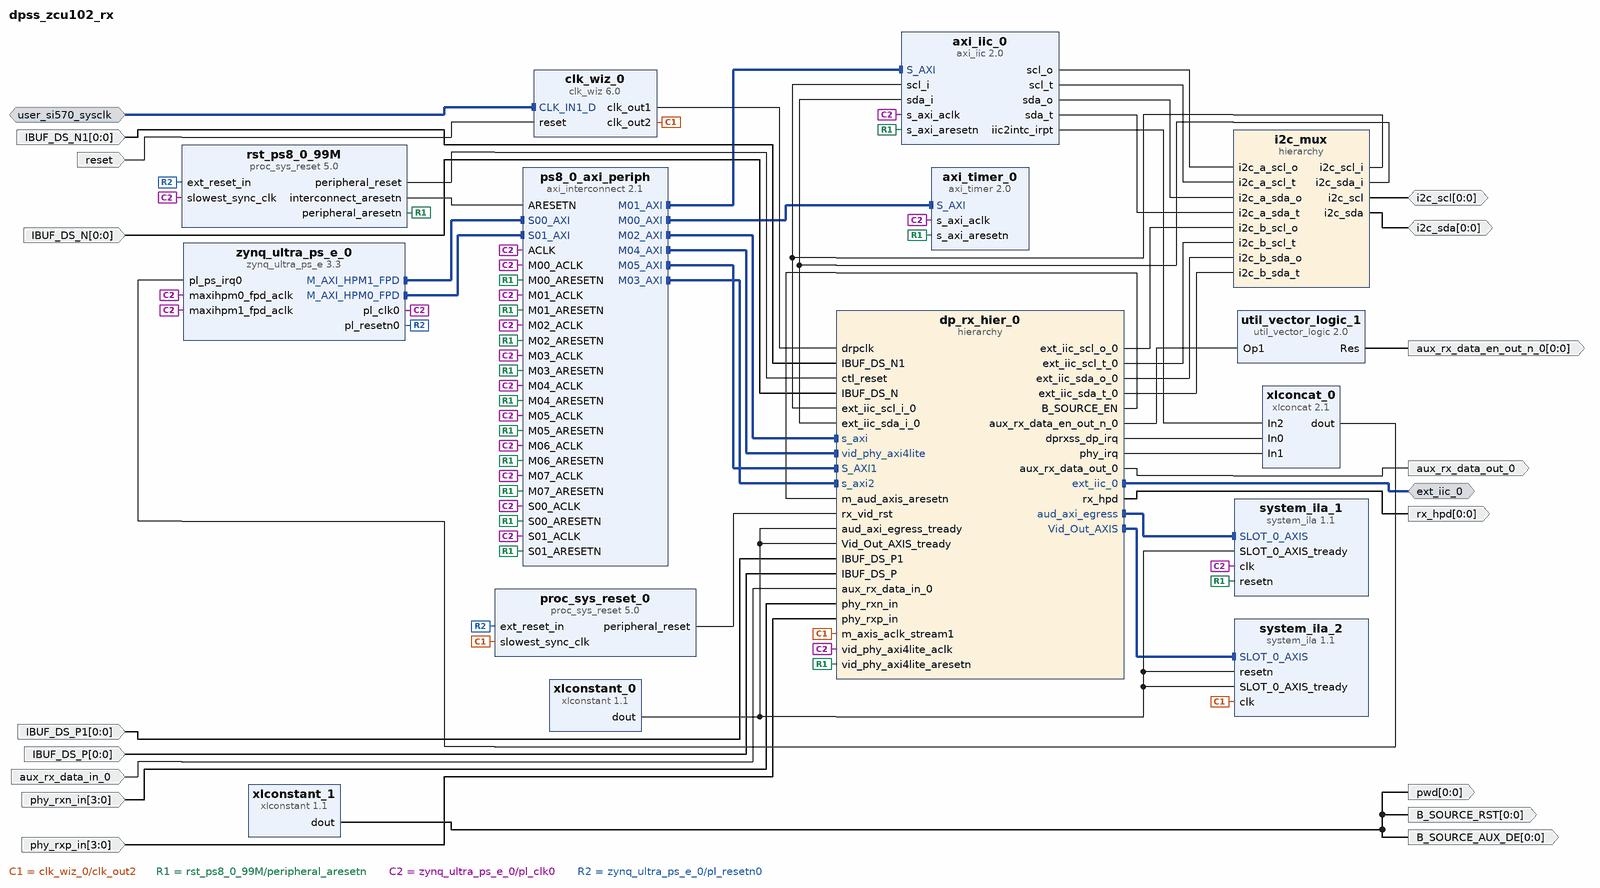
[diagram p0: block diagram of the top level]
# Vivado block design dpss_zcu102_rx, xczu9eg-ffvb1156-2-e, Vivado 2019.2
create_bd_design dpss_zcu102_rx

create_bd_intf_port -mode Master -vlnv xilinx.com:interface:iic_rtl:1.0 ext_iic_0
create_bd_intf_port -mode Slave -vlnv xilinx.com:interface:diff_clock_rtl:1.0 user_si570_sysclk
set_property -dict {CONFIG.FREQ_HZ 300000000} [get_bd_intf_ports user_si570_sysclk]
create_bd_port -dir O -from 0 -to 0 B_SOURCE_AUX_DE
create_bd_port -dir O -from 0 -to 0 B_SOURCE_RST
create_bd_port -dir I -from 0 -to 0 -type clk IBUF_DS_N
create_bd_port -dir I -from 0 -to 0 -type clk IBUF_DS_N1
create_bd_port -dir I -from 0 -to 0 -type clk IBUF_DS_P
create_bd_port -dir I -from 0 -to 0 -type clk IBUF_DS_P1
create_bd_port -dir O -from 0 -to 0 aux_rx_data_en_out_n_0
create_bd_port -dir I aux_rx_data_in_0
create_bd_port -dir O aux_rx_data_out_0
create_bd_port -dir IO -from 0 -to 0 i2c_scl
create_bd_port -dir IO -from 0 -to 0 i2c_sda
create_bd_port -dir I -from 3 -to 0 phy_rxn_in
create_bd_port -dir I -from 3 -to 0 phy_rxp_in
create_bd_port -dir O -from 0 -to 0 pwd
create_bd_port -dir I -type rst reset
set_property -dict {CONFIG.POLARITY ACTIVE_HIGH} [get_bd_ports reset]
create_bd_port -dir O -from 0 -to 0 -type data rx_hpd

create_bd_cell -type ip -vlnv xilinx.com:ip:axi_iic:2.0 axi_iic_0
set_property -dict {CONFIG.C_GPO_WIDTH 2 CONFIG.IIC_FREQ_KHZ 10} [get_bd_cells axi_iic_0]
create_bd_cell -type ip -vlnv xilinx.com:ip:axi_timer:2.0 axi_timer_0
create_bd_cell -type ip -vlnv xilinx.com:ip:clk_wiz:6.0 clk_wiz_0
set_property -dict [list \
  CONFIG.CLKOUT1_JITTER 119.271 \
  CONFIG.CLKOUT1_REQUESTED_OUT_FREQ 40 \
  CONFIG.CLKOUT2_JITTER 77.563 \
  CONFIG.CLKOUT2_PHASE_ERROR 77.959 \
  CONFIG.CLKOUT2_REQUESTED_OUT_FREQ 350.000 \
  CONFIG.CLKOUT2_USED true \
  CONFIG.CLK_IN1_BOARD_INTERFACE user_si570_sysclk \
  CONFIG.MMCM_CLKOUT0_DIVIDE_F 26.250 \
  CONFIG.MMCM_CLKOUT1_DIVIDE 3 \
  CONFIG.MMCM_DIVCLK_DIVIDE 1 \
  CONFIG.NUM_OUT_CLKS 2 \
  CONFIG.RESET_BOARD_INTERFACE reset \
  CONFIG.USE_BOARD_FLOW true \
] [get_bd_cells clk_wiz_0]
create_bd_cell -type hier dp_rx_hier_0
create_bd_cell -type hier i2c_mux
create_bd_cell -type ip -vlnv xilinx.com:ip:proc_sys_reset:5.0 proc_sys_reset_0
create_bd_cell -type ip -vlnv xilinx.com:ip:axi_interconnect:2.1 ps8_0_axi_periph
set_property -dict {CONFIG.NUM_MI 8 CONFIG.NUM_SI 2} [get_bd_cells ps8_0_axi_periph]
create_bd_cell -type ip -vlnv xilinx.com:ip:proc_sys_reset:5.0 rst_ps8_0_99M
create_bd_cell -type ip -vlnv xilinx.com:ip:system_ila:1.1 system_ila_1
set_property -dict [list \
  CONFIG.C_MON_TYPE INTERFACE \
  CONFIG.C_SLOT_0_INTF_TYPE xilinx.com:interface:axis_rtl:1.0 \
] [get_bd_cells system_ila_1]
create_bd_cell -type ip -vlnv xilinx.com:ip:system_ila:1.1 system_ila_2
set_property -dict [list \
  CONFIG.C_MON_TYPE INTERFACE \
  CONFIG.C_SLOT_0_INTF_TYPE xilinx.com:interface:axis_rtl:1.0 \
] [get_bd_cells system_ila_2]
create_bd_cell -type ip -vlnv xilinx.com:ip:util_vector_logic:2.0 util_vector_logic_1
set_property -dict {CONFIG.C_OPERATION not CONFIG.C_SIZE 1} [get_bd_cells util_vector_logic_1]
create_bd_cell -type ip -vlnv xilinx.com:ip:xlconcat:2.1 xlconcat_0
set_property -dict {CONFIG.NUM_PORTS 3} [get_bd_cells xlconcat_0]
create_bd_cell -type ip -vlnv xilinx.com:ip:xlconstant:1.1 xlconstant_0
create_bd_cell -type ip -vlnv xilinx.com:ip:xlconstant:1.1 xlconstant_1
set_property -dict {CONFIG.CONST_VAL 0} [get_bd_cells xlconstant_1]
create_bd_cell -type ip -vlnv xilinx.com:ip:zynq_ultra_ps_e:3.3 zynq_ultra_ps_e_0
set_property -dict [list \
  CONFIG.CAN0_BOARD_INTERFACE custom \
  CONFIG.CAN1_BOARD_INTERFACE custom \
  CONFIG.CSU_BOARD_INTERFACE custom \
  CONFIG.DP_BOARD_INTERFACE custom \
  CONFIG.GEM0_BOARD_INTERFACE custom \
  CONFIG.GEM1_BOARD_INTERFACE custom \
  CONFIG.GEM2_BOARD_INTERFACE custom \
  CONFIG.GEM3_BOARD_INTERFACE custom \
  CONFIG.GPIO_BOARD_INTERFACE custom \
  CONFIG.IIC0_BOARD_INTERFACE custom \
  CONFIG.IIC1_BOARD_INTERFACE custom \
  CONFIG.NAND_BOARD_INTERFACE custom \
  CONFIG.PCIE_BOARD_INTERFACE custom \
  CONFIG.PJTAG_BOARD_INTERFACE custom \
  CONFIG.PMU_BOARD_INTERFACE custom \
  CONFIG.PSU_BANK_0_IO_STANDARD LVCMOS18 \
  CONFIG.PSU_BANK_1_IO_STANDARD LVCMOS18 \
  CONFIG.PSU_BANK_2_IO_STANDARD LVCMOS18 \
  CONFIG.PSU_BANK_3_IO_STANDARD LVCMOS33 \
  CONFIG.PSU_USB3__DUAL_CLOCK_ENABLE 1 \
  CONFIG.PSU__CAN1__PERIPHERAL__ENABLE 1 \
  CONFIG.PSU__CAN1__PERIPHERAL__IO {MIO 24 .. 25} \
  CONFIG.PSU__CRF_APB__ACPU_CTRL__FREQMHZ 1200 \
  CONFIG.PSU__CRF_APB__ACPU_CTRL__SRCSEL APLL \
  CONFIG.PSU__CRF_APB__APLL_CTRL__SRCSEL PSS_REF_CLK \
  CONFIG.PSU__CRF_APB__DBG_FPD_CTRL__FREQMHZ 250 \
  CONFIG.PSU__CRF_APB__DBG_FPD_CTRL__SRCSEL IOPLL \
  CONFIG.PSU__CRF_APB__DBG_TRACE_CTRL__FREQMHZ 250 \
  CONFIG.PSU__CRF_APB__DBG_TRACE_CTRL__SRCSEL IOPLL \
  CONFIG.PSU__CRF_APB__DBG_TSTMP_CTRL__FREQMHZ 250 \
  CONFIG.PSU__CRF_APB__DBG_TSTMP_CTRL__SRCSEL IOPLL \
  CONFIG.PSU__CRF_APB__DDR_CTRL__FREQMHZ 1067 \
  CONFIG.PSU__CRF_APB__DDR_CTRL__SRCSEL DPLL \
  CONFIG.PSU__CRF_APB__DPDMA_REF_CTRL__FREQMHZ 600 \
  CONFIG.PSU__CRF_APB__DPDMA_REF_CTRL__SRCSEL APLL \
  CONFIG.PSU__CRF_APB__DPLL_CTRL__SRCSEL PSS_REF_CLK \
  CONFIG.PSU__CRF_APB__DP_AUDIO_REF_CTRL__SRCSEL RPLL \
  CONFIG.PSU__CRF_APB__DP_STC_REF_CTRL__SRCSEL RPLL \
  CONFIG.PSU__CRF_APB__DP_VIDEO_REF_CTRL__SRCSEL VPLL \
  CONFIG.PSU__CRF_APB__GDMA_REF_CTRL__FREQMHZ 600 \
  CONFIG.PSU__CRF_APB__GDMA_REF_CTRL__SRCSEL APLL \
  CONFIG.PSU__CRF_APB__GPU_REF_CTRL__FREQMHZ 500 \
  CONFIG.PSU__CRF_APB__GPU_REF_CTRL__SRCSEL IOPLL \
  CONFIG.PSU__CRF_APB__TOPSW_LSBUS_CTRL__FREQMHZ 100 \
  CONFIG.PSU__CRF_APB__TOPSW_LSBUS_CTRL__SRCSEL IOPLL \
  CONFIG.PSU__CRF_APB__TOPSW_MAIN_CTRL__FREQMHZ 533.33 \
  CONFIG.PSU__CRF_APB__TOPSW_MAIN_CTRL__SRCSEL DPLL \
  CONFIG.PSU__CRF_APB__VPLL_CTRL__SRCSEL PSS_REF_CLK \
  CONFIG.PSU__CRL_APB__ADMA_REF_CTRL__FREQMHZ 500 \
  CONFIG.PSU__CRL_APB__ADMA_REF_CTRL__SRCSEL IOPLL \
  CONFIG.PSU__CRL_APB__CAN1_REF_CTRL__FREQMHZ 100 \
  CONFIG.PSU__CRL_APB__CAN1_REF_CTRL__SRCSEL IOPLL \
  CONFIG.PSU__CRL_APB__CPU_R5_CTRL__FREQMHZ 500 \
  CONFIG.PSU__CRL_APB__CPU_R5_CTRL__SRCSEL IOPLL \
  CONFIG.PSU__CRL_APB__DBG_LPD_CTRL__FREQMHZ 250 \
  CONFIG.PSU__CRL_APB__DBG_LPD_CTRL__SRCSEL IOPLL \
  CONFIG.PSU__CRL_APB__GEM3_REF_CTRL__FREQMHZ 125 \
  CONFIG.PSU__CRL_APB__GEM3_REF_CTRL__SRCSEL IOPLL \
  CONFIG.PSU__CRL_APB__I2C0_REF_CTRL__FREQMHZ 100 \
  CONFIG.PSU__CRL_APB__I2C0_REF_CTRL__SRCSEL IOPLL \
  CONFIG.PSU__CRL_APB__I2C1_REF_CTRL__FREQMHZ 100 \
  CONFIG.PSU__CRL_APB__I2C1_REF_CTRL__SRCSEL IOPLL \
  CONFIG.PSU__CRL_APB__IOPLL_CTRL__SRCSEL PSS_REF_CLK \
  CONFIG.PSU__CRL_APB__IOU_SWITCH_CTRL__FREQMHZ 250 \
  CONFIG.PSU__CRL_APB__IOU_SWITCH_CTRL__SRCSEL IOPLL \
  CONFIG.PSU__CRL_APB__LPD_LSBUS_CTRL__FREQMHZ 100 \
  CONFIG.PSU__CRL_APB__LPD_LSBUS_CTRL__SRCSEL IOPLL \
  CONFIG.PSU__CRL_APB__LPD_SWITCH_CTRL__FREQMHZ 500 \
  CONFIG.PSU__CRL_APB__LPD_SWITCH_CTRL__SRCSEL IOPLL \
  CONFIG.PSU__CRL_APB__PCAP_CTRL__FREQMHZ 200 \
  CONFIG.PSU__CRL_APB__PCAP_CTRL__SRCSEL IOPLL \
  CONFIG.PSU__CRL_APB__PL0_REF_CTRL__FREQMHZ 100 \
  CONFIG.PSU__CRL_APB__PL0_REF_CTRL__SRCSEL IOPLL \
  CONFIG.PSU__CRL_APB__QSPI_REF_CTRL__FREQMHZ 125 \
  CONFIG.PSU__CRL_APB__QSPI_REF_CTRL__SRCSEL IOPLL \
  CONFIG.PSU__CRL_APB__RPLL_CTRL__SRCSEL PSS_REF_CLK \
  CONFIG.PSU__CRL_APB__SDIO1_REF_CTRL__FREQMHZ 200 \
  CONFIG.PSU__CRL_APB__SDIO1_REF_CTRL__SRCSEL IOPLL \
  CONFIG.PSU__CRL_APB__TIMESTAMP_REF_CTRL__FREQMHZ 100 \
  CONFIG.PSU__CRL_APB__TIMESTAMP_REF_CTRL__SRCSEL IOPLL \
  CONFIG.PSU__CRL_APB__UART0_REF_CTRL__FREQMHZ 100 \
  CONFIG.PSU__CRL_APB__UART0_REF_CTRL__SRCSEL IOPLL \
  CONFIG.PSU__CRL_APB__UART1_REF_CTRL__FREQMHZ 100 \
  CONFIG.PSU__CRL_APB__UART1_REF_CTRL__SRCSEL IOPLL \
  CONFIG.PSU__CRL_APB__USB0_BUS_REF_CTRL__FREQMHZ 250 \
  CONFIG.PSU__CRL_APB__USB0_BUS_REF_CTRL__SRCSEL IOPLL \
  CONFIG.PSU__CRL_APB__USB3_DUAL_REF_CTRL__FREQMHZ 20 \
  CONFIG.PSU__CRL_APB__USB3_DUAL_REF_CTRL__SRCSEL IOPLL \
  CONFIG.PSU__CRL_APB__USB3__ENABLE 1 \
  CONFIG.PSU__CSUPMU__PERIPHERAL__VALID 1 \
  CONFIG.PSU__DDRC__BUS_WIDTH {64 Bit} \
  CONFIG.PSU__DDRC__COMPONENTS UDIMM \
  CONFIG.PSU__DDRC__DEVICE_CAPACITY {4096 MBits} \
  CONFIG.PSU__DDRC__DRAM_WIDTH {8 Bits} \
  CONFIG.PSU__DDRC__ECC Disabled \
  CONFIG.PSU__DDRC__MEMORY_TYPE {DDR 4} \
  CONFIG.PSU__DDRC__SPEED_BIN DDR4_2133P \
  CONFIG.PSU__DDR_HIGH_ADDRESS_GUI_ENABLE 1 \
  CONFIG.PSU__DDR__INTERFACE__FREQMHZ 533.500 \
  CONFIG.PSU__DEVICE_TYPE EG \
  CONFIG.PSU__DISPLAYPORT__LANE0__ENABLE 1 \
  CONFIG.PSU__DISPLAYPORT__LANE0__IO {GT Lane1} \
  CONFIG.PSU__DISPLAYPORT__LANE1__ENABLE 0 \
  CONFIG.PSU__DISPLAYPORT__PERIPHERAL__ENABLE 1 \
  CONFIG.PSU__DLL__ISUSED 1 \
  CONFIG.PSU__DPAUX__PERIPHERAL__ENABLE 1 \
  CONFIG.PSU__DPAUX__PERIPHERAL__IO {MIO 27 .. 30} \
  CONFIG.PSU__DP__LANE_SEL {Single Lower} \
  CONFIG.PSU__DP__REF_CLK_FREQ 27 \
  CONFIG.PSU__DP__REF_CLK_SEL {Ref Clk3} \
  CONFIG.PSU__ENET3__FIFO__ENABLE 0 \
  CONFIG.PSU__ENET3__GRP_MDIO__ENABLE 1 \
  CONFIG.PSU__ENET3__GRP_MDIO__IO {MIO 76 .. 77} \
  CONFIG.PSU__ENET3__PERIPHERAL__ENABLE 1 \
  CONFIG.PSU__ENET3__PERIPHERAL__IO {MIO 64 .. 75} \
  CONFIG.PSU__ENET3__PTP__ENABLE 0 \
  CONFIG.PSU__ENET3__TSU__ENABLE 0 \
  CONFIG.PSU__FPGA_PL0_ENABLE 1 \
  CONFIG.PSU__GEM3_COHERENCY 0 \
  CONFIG.PSU__GEM3_ROUTE_THROUGH_FPD 0 \
  CONFIG.PSU__GEM__TSU__ENABLE 0 \
  CONFIG.PSU__GPIO0_MIO__IO {MIO 0 .. 25} \
  CONFIG.PSU__GPIO0_MIO__PERIPHERAL__ENABLE 1 \
  CONFIG.PSU__GPIO1_MIO__IO {MIO 26 .. 51} \
  CONFIG.PSU__GPIO1_MIO__PERIPHERAL__ENABLE 1 \
  CONFIG.PSU__GT__LINK_SPEED HBR \
  CONFIG.PSU__GT__PRE_EMPH_LVL_4 0 \
  CONFIG.PSU__GT__VLT_SWNG_LVL_4 0 \
  CONFIG.PSU__I2C0__PERIPHERAL__ENABLE 1 \
  CONFIG.PSU__I2C0__PERIPHERAL__IO {MIO 14 .. 15} \
  CONFIG.PSU__I2C1__PERIPHERAL__ENABLE 1 \
  CONFIG.PSU__I2C1__PERIPHERAL__IO {MIO 16 .. 17} \
  CONFIG.PSU__IOU_SLCR__IOU_TTC_APB_CLK__TTC0_SEL APB \
  CONFIG.PSU__IOU_SLCR__IOU_TTC_APB_CLK__TTC1_SEL APB \
  CONFIG.PSU__IOU_SLCR__IOU_TTC_APB_CLK__TTC2_SEL APB \
  CONFIG.PSU__IOU_SLCR__IOU_TTC_APB_CLK__TTC3_SEL APB \
  CONFIG.PSU__MAXIGP0__DATA_WIDTH 128 \
  CONFIG.PSU__OVERRIDE__BASIC_CLOCK 0 \
  CONFIG.PSU__PCIE__BAR0_VAL 0x0 \
  CONFIG.PSU__PCIE__BAR1_VAL 0x0 \
  CONFIG.PSU__PCIE__BAR2_VAL 0x0 \
  CONFIG.PSU__PCIE__BAR3_VAL 0x0 \
  CONFIG.PSU__PCIE__BAR4_VAL 0x0 \
  CONFIG.PSU__PCIE__BAR5_VAL 0x0 \
  CONFIG.PSU__PCIE__CLASS_CODE_BASE 0x06 \
  CONFIG.PSU__PCIE__CLASS_CODE_INTERFACE 0x0 \
  CONFIG.PSU__PCIE__CLASS_CODE_SUB 0x4 \
  CONFIG.PSU__PCIE__CLASS_CODE_VALUE 0x60400 \
  CONFIG.PSU__PCIE__CRS_SW_VISIBILITY 1 \
  CONFIG.PSU__PCIE__DEVICE_ID 0xD021 \
  CONFIG.PSU__PCIE__DEVICE_PORT_TYPE {Root Port} \
  CONFIG.PSU__PCIE__EROM_VAL 0x0 \
  CONFIG.PSU__PCIE__LANE0__ENABLE 1 \
  CONFIG.PSU__PCIE__LANE0__IO {GT Lane0} \
  CONFIG.PSU__PCIE__LINK_SPEED {5.0 Gb/s} \
  CONFIG.PSU__PCIE__MAXIMUM_LINK_WIDTH x1 \
  CONFIG.PSU__PCIE__MAX_PAYLOAD_SIZE {256 bytes} \
  CONFIG.PSU__PCIE__PERIPHERAL__ENABLE 1 \
  CONFIG.PSU__PCIE__PERIPHERAL__ENDPOINT_ENABLE 0 \
  CONFIG.PSU__PCIE__PERIPHERAL__ROOTPORT_ENABLE 1 \
  CONFIG.PSU__PCIE__PERIPHERAL__ROOTPORT_IO {MIO 31} \
  CONFIG.PSU__PCIE__REF_CLK_FREQ 100 \
  CONFIG.PSU__PCIE__REF_CLK_SEL {Ref Clk0} \
  CONFIG.PSU__PCIE__REVISION_ID 0x0 \
  CONFIG.PSU__PCIE__SUBSYSTEM_ID 0x7 \
  CONFIG.PSU__PCIE__SUBSYSTEM_VENDOR_ID 0x10EE \
  CONFIG.PSU__PCIE__VENDOR_ID 0x10EE \
  CONFIG.PSU__PMU_COHERENCY 0 \
  CONFIG.PSU__PMU__AIBACK__ENABLE 0 \
  CONFIG.PSU__PMU__EMIO_GPI__ENABLE 0 \
  CONFIG.PSU__PMU__EMIO_GPO__ENABLE 0 \
  CONFIG.PSU__PMU__GPI0__ENABLE 0 \
  CONFIG.PSU__PMU__GPI1__ENABLE 0 \
  CONFIG.PSU__PMU__GPI2__ENABLE 0 \
  CONFIG.PSU__PMU__GPI3__ENABLE 0 \
  CONFIG.PSU__PMU__GPI4__ENABLE 0 \
  CONFIG.PSU__PMU__GPI5__ENABLE 0 \
  CONFIG.PSU__PMU__GPO0__ENABLE 1 \
  CONFIG.PSU__PMU__GPO0__IO {MIO 32} \
  CONFIG.PSU__PMU__GPO1__ENABLE 1 \
  CONFIG.PSU__PMU__GPO1__IO {MIO 33} \
  CONFIG.PSU__PMU__GPO2__ENABLE 1 \
  CONFIG.PSU__PMU__GPO2__IO {MIO 34} \
  CONFIG.PSU__PMU__GPO2__POLARITY low \
  CONFIG.PSU__PMU__GPO3__ENABLE 1 \
  CONFIG.PSU__PMU__GPO3__IO {MIO 35} \
  CONFIG.PSU__PMU__GPO3__POLARITY low \
  CONFIG.PSU__PMU__GPO4__ENABLE 1 \
  CONFIG.PSU__PMU__GPO4__IO {MIO 36} \
  CONFIG.PSU__PMU__GPO4__POLARITY low \
  CONFIG.PSU__PMU__GPO5__ENABLE 1 \
  CONFIG.PSU__PMU__GPO5__IO {MIO 37} \
  CONFIG.PSU__PMU__GPO5__POLARITY low \
  CONFIG.PSU__PMU__PERIPHERAL__ENABLE 1 \
  CONFIG.PSU__PMU__PLERROR__ENABLE 0 \
  CONFIG.PSU__PRESET_APPLIED 0 \
  CONFIG.PSU__PSS_REF_CLK__FREQMHZ 33.333 \
  CONFIG.PSU__QSPI_COHERENCY 0 \
  CONFIG.PSU__QSPI_ROUTE_THROUGH_FPD 0 \
  CONFIG.PSU__QSPI__GRP_FBCLK__ENABLE 1 \
  CONFIG.PSU__QSPI__GRP_FBCLK__IO {MIO 6} \
  CONFIG.PSU__QSPI__PERIPHERAL__DATA_MODE x4 \
  CONFIG.PSU__QSPI__PERIPHERAL__ENABLE 1 \
  CONFIG.PSU__QSPI__PERIPHERAL__IO {MIO 0 .. 12} \
  CONFIG.PSU__QSPI__PERIPHERAL__MODE {Dual Parallel} \
  CONFIG.PSU__SATA__LANE1__IO {GT Lane3} \
  CONFIG.PSU__SATA__PERIPHERAL__ENABLE 1 \
  CONFIG.PSU__SATA__REF_CLK_FREQ 125 \
  CONFIG.PSU__SATA__REF_CLK_SEL {Ref Clk1} \
  CONFIG.PSU__SD1_COHERENCY 0 \
  CONFIG.PSU__SD1_ROUTE_THROUGH_FPD 0 \
  CONFIG.PSU__SD1__DATA_TRANSFER_MODE 8Bit \
  CONFIG.PSU__SD1__GRP_CD__ENABLE 1 \
  CONFIG.PSU__SD1__GRP_CD__IO {MIO 45} \
  CONFIG.PSU__SD1__GRP_POW__ENABLE 1 \
  CONFIG.PSU__SD1__GRP_POW__IO {MIO 43} \
  CONFIG.PSU__SD1__GRP_WP__ENABLE 1 \
  CONFIG.PSU__SD1__GRP_WP__IO {MIO 44} \
  CONFIG.PSU__SD1__PERIPHERAL__ENABLE 1 \
  CONFIG.PSU__SD1__PERIPHERAL__IO {MIO 39 .. 51} \
  CONFIG.PSU__SD1__SLOT_TYPE {SD 3.0} \
  CONFIG.PSU__SWDT0__CLOCK__ENABLE 0 \
  CONFIG.PSU__SWDT0__PERIPHERAL__ENABLE 1 \
  CONFIG.PSU__SWDT0__RESET__ENABLE 0 \
  CONFIG.PSU__SWDT1__CLOCK__ENABLE 0 \
  CONFIG.PSU__SWDT1__PERIPHERAL__ENABLE 1 \
  CONFIG.PSU__SWDT1__RESET__ENABLE 0 \
  CONFIG.PSU__TSU__BUFG_PORT_PAIR 0 \
  CONFIG.PSU__TTC0__CLOCK__ENABLE 0 \
  CONFIG.PSU__TTC0__PERIPHERAL__ENABLE 1 \
  CONFIG.PSU__TTC0__WAVEOUT__ENABLE 0 \
  CONFIG.PSU__TTC1__CLOCK__ENABLE 0 \
  CONFIG.PSU__TTC1__PERIPHERAL__ENABLE 1 \
  CONFIG.PSU__TTC1__WAVEOUT__ENABLE 0 \
  CONFIG.PSU__TTC2__CLOCK__ENABLE 0 \
  CONFIG.PSU__TTC2__PERIPHERAL__ENABLE 1 \
  CONFIG.PSU__TTC2__WAVEOUT__ENABLE 0 \
  CONFIG.PSU__TTC3__CLOCK__ENABLE 0 \
  CONFIG.PSU__TTC3__PERIPHERAL__ENABLE 1 \
  CONFIG.PSU__TTC3__WAVEOUT__ENABLE 0 \
  CONFIG.PSU__UART0__BAUD_RATE 115200 \
  CONFIG.PSU__UART0__MODEM__ENABLE 0 \
  CONFIG.PSU__UART0__PERIPHERAL__ENABLE 1 \
  CONFIG.PSU__UART0__PERIPHERAL__IO {MIO 18 .. 19} \
  CONFIG.PSU__UART1__BAUD_RATE 115200 \
  CONFIG.PSU__UART1__MODEM__ENABLE 0 \
  CONFIG.PSU__UART1__PERIPHERAL__ENABLE 1 \
  CONFIG.PSU__UART1__PERIPHERAL__IO {MIO 20 .. 21} \
  CONFIG.PSU__USB0_COHERENCY 0 \
  CONFIG.PSU__USB0__PERIPHERAL__ENABLE 1 \
  CONFIG.PSU__USB0__PERIPHERAL__IO {MIO 52 .. 63} \
  CONFIG.PSU__USB0__REF_CLK_FREQ 26 \
  CONFIG.PSU__USB0__REF_CLK_SEL {Ref Clk2} \
  CONFIG.PSU__USB2_0__EMIO__ENABLE 0 \
  CONFIG.PSU__USB3_0__EMIO__ENABLE 0 \
  CONFIG.PSU__USB3_0__PERIPHERAL__ENABLE 1 \
  CONFIG.PSU__USB3_0__PERIPHERAL__IO {GT Lane2} \
  CONFIG.PSU__USB__RESET__MODE {Boot Pin} \
  CONFIG.PSU__USB__RESET__POLARITY {Active Low} \
  CONFIG.PSU__USE__IRQ0 1 \
  CONFIG.PSU__USE__M_AXI_GP0 1 \
  CONFIG.PSU__USE__M_AXI_GP1 1 \
  CONFIG.PSU__USE__M_AXI_GP2 0 \
  CONFIG.QSPI_BOARD_INTERFACE custom \
  CONFIG.SATA_BOARD_INTERFACE custom \
  CONFIG.SD0_BOARD_INTERFACE custom \
  CONFIG.SD1_BOARD_INTERFACE custom \
  CONFIG.SPI0_BOARD_INTERFACE custom \
  CONFIG.SPI1_BOARD_INTERFACE custom \
  CONFIG.SUBPRESET1 Custom \
  CONFIG.SUBPRESET2 Custom \
  CONFIG.SWDT0_BOARD_INTERFACE custom \
  CONFIG.SWDT1_BOARD_INTERFACE custom \
  CONFIG.TRACE_BOARD_INTERFACE custom \
  CONFIG.TTC0_BOARD_INTERFACE custom \
  CONFIG.TTC1_BOARD_INTERFACE custom \
  CONFIG.TTC2_BOARD_INTERFACE custom \
  CONFIG.TTC3_BOARD_INTERFACE custom \
  CONFIG.UART0_BOARD_INTERFACE custom \
  CONFIG.UART1_BOARD_INTERFACE custom \
  CONFIG.USB0_BOARD_INTERFACE custom \
  CONFIG.USB1_BOARD_INTERFACE custom \
] [get_bd_cells zynq_ultra_ps_e_0]
# 726 more settings of zynq_ultra_ps_e_0 are not shown: defaults, MIO pin electricals, DDR timing, and values the tool derives

# ---- hierarchy /dp_rx_hier_0 ----
current_bd_instance /dp_rx_hier_0
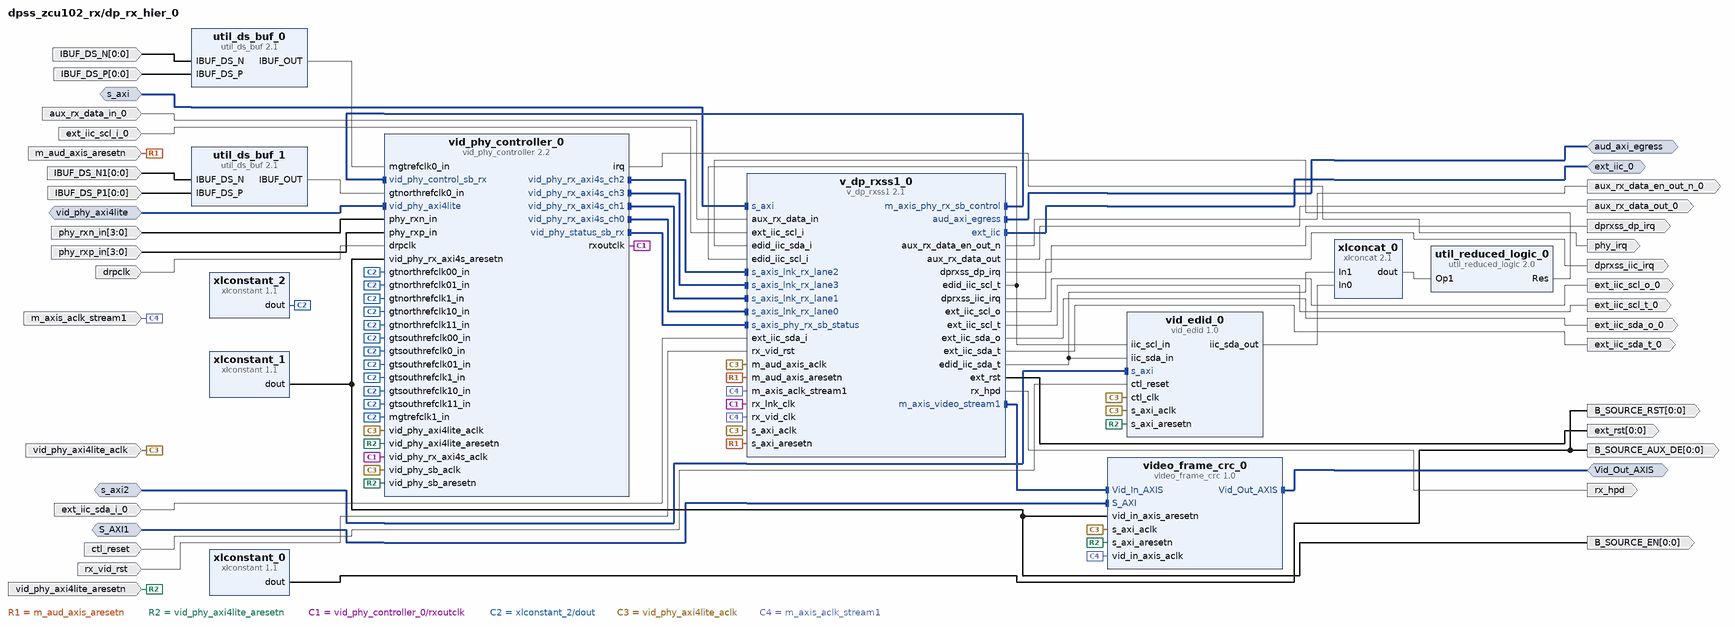
[diagram p1: block diagram inside /dp_rx_hier_0]
create_bd_intf_pin -mode Slave -vlnv xilinx.com:interface:aximm_rtl:1.0 S_AXI1
create_bd_intf_pin -mode Master -vlnv xilinx.com:interface:axis_rtl:1.0 Vid_Out_AXIS
create_bd_intf_pin -mode Master -vlnv xilinx.com:interface:axis_rtl:1.0 aud_axi_egress
create_bd_intf_pin -mode Master -vlnv xilinx.com:interface:iic_rtl:1.0 ext_iic_0
create_bd_intf_pin -mode Slave -vlnv xilinx.com:interface:aximm_rtl:1.0 s_axi
create_bd_intf_pin -mode Slave -vlnv xilinx.com:interface:aximm_rtl:1.0 s_axi2
create_bd_intf_pin -mode Slave -vlnv xilinx.com:interface:aximm_rtl:1.0 vid_phy_axi4lite
create_bd_pin -dir O -from 0 -to 0 B_SOURCE_AUX_DE
create_bd_pin -dir O -from 0 -to 0 B_SOURCE_EN
create_bd_pin -dir O -from 0 -to 0 B_SOURCE_RST
create_bd_pin -dir I -from 0 -to 0 -type clk IBUF_DS_N
create_bd_pin -dir I -from 0 -to 0 -type clk IBUF_DS_N1
create_bd_pin -dir I -from 0 -to 0 -type clk IBUF_DS_P
create_bd_pin -dir I -from 0 -to 0 -type clk IBUF_DS_P1
create_bd_pin -dir O aux_rx_data_en_out_n_0
create_bd_pin -dir I aux_rx_data_in_0
create_bd_pin -dir O aux_rx_data_out_0
create_bd_pin -dir I ctl_reset
create_bd_pin -dir O dprxss_dp_irq
create_bd_pin -dir O dprxss_iic_irq
create_bd_pin -dir I -type clk drpclk
create_bd_pin -dir I ext_iic_scl_i_0
create_bd_pin -dir O ext_iic_scl_o_0
create_bd_pin -dir O ext_iic_scl_t_0
create_bd_pin -dir I ext_iic_sda_i_0
create_bd_pin -dir O ext_iic_sda_o_0
create_bd_pin -dir O ext_iic_sda_t_0
create_bd_pin -dir O -from 0 -to 0 ext_rst
create_bd_pin -dir I -type rst m_aud_axis_aresetn
create_bd_pin -dir I -type clk m_axis_aclk_stream1
create_bd_pin -dir O phy_irq
create_bd_pin -dir I -from 3 -to 0 phy_rxn_in
create_bd_pin -dir I -from 3 -to 0 phy_rxp_in
create_bd_pin -dir O -type data rx_hpd
create_bd_pin -dir I rx_vid_rst
create_bd_pin -dir I -type clk vid_phy_axi4lite_aclk
create_bd_pin -dir I -type rst vid_phy_axi4lite_aresetn

create_bd_cell -type ip -vlnv xilinx.com:ip:util_ds_buf:2.1 util_ds_buf_0
set_property -dict {CONFIG.C_BUF_TYPE IBUFDSGTE} [get_bd_cells util_ds_buf_0]
create_bd_cell -type ip -vlnv xilinx.com:ip:util_ds_buf:2.1 util_ds_buf_1
set_property -dict {CONFIG.C_BUF_TYPE IBUFDSGTE} [get_bd_cells util_ds_buf_1]
create_bd_cell -type ip -vlnv xilinx.com:ip:util_reduced_logic:2.0 util_reduced_logic_0
set_property -dict {CONFIG.C_SIZE 2} [get_bd_cells util_reduced_logic_0]
create_bd_cell -type ip -vlnv xilinx.com:ip:v_dp_rxss1:2.1 v_dp_rxss1_0
set_property -dict [list \
  CONFIG.AUDIO_ENABLE 1 \
  CONFIG.AUX_IO_LOC 1 \
  CONFIG.BITS_PER_COLOR 10 \
  CONFIG.PHY_DATA_WIDTH 2 \
] [get_bd_cells v_dp_rxss1_0]
create_bd_cell -type ip -vlnv xilinx.com:ip:vid_edid:1.0 vid_edid_0
create_bd_cell -type ip -vlnv xilinx.com:ip:vid_phy_controller:2.2 vid_phy_controller_0
set_property -dict [list \
  CONFIG.Adv_Clk_Mode true \
  CONFIG.CHANNEL_ENABLE {X1Y8 X1Y9 X1Y10 X1Y11} \
  CONFIG.CHANNEL_SITE X1Y8 \
  CONFIG.C_RX_REFCLK_SEL 1 \
  CONFIG.C_TX_REFCLK_SEL 0 \
  CONFIG.C_Tx_Protocol None \
  CONFIG.C_Tx_SB_Ports false \
  CONFIG.Rx_Max_GT_Line_Rate 8.1 \
  CONFIG.Transceiver_Width 2 \
] [get_bd_cells vid_phy_controller_0]
create_bd_cell -type ip -vlnv xilinx.com:ip:video_frame_crc:1.0 video_frame_crc_0
set_property -dict {CONFIG.BPC 10} [get_bd_cells video_frame_crc_0]
create_bd_cell -type ip -vlnv xilinx.com:ip:xlconcat:2.1 xlconcat_0
create_bd_cell -type ip -vlnv xilinx.com:ip:xlconstant:1.1 xlconstant_0
set_property -dict {CONFIG.CONST_VAL 0} [get_bd_cells xlconstant_0]
create_bd_cell -type ip -vlnv xilinx.com:ip:xlconstant:1.1 xlconstant_1
create_bd_cell -type ip -vlnv xilinx.com:ip:xlconstant:1.1 xlconstant_2
set_property -dict {CONFIG.CONST_VAL 0} [get_bd_cells xlconstant_2]

# ---- hierarchy /i2c_mux ----
current_bd_instance /i2c_mux
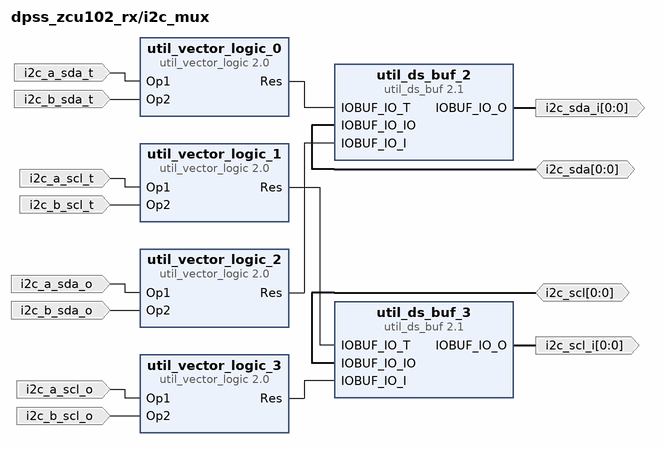
[diagram p2: block diagram inside /i2c_mux]
create_bd_pin -dir I i2c_a_scl_o
create_bd_pin -dir I i2c_a_scl_t
create_bd_pin -dir I i2c_a_sda_o
create_bd_pin -dir I i2c_a_sda_t
create_bd_pin -dir I i2c_b_scl_o
create_bd_pin -dir I i2c_b_scl_t
create_bd_pin -dir I i2c_b_sda_o
create_bd_pin -dir I i2c_b_sda_t
create_bd_pin -dir IO -from 0 -to 0 i2c_scl
create_bd_pin -dir O -from 0 -to 0 i2c_scl_i
create_bd_pin -dir IO -from 0 -to 0 i2c_sda
create_bd_pin -dir O -from 0 -to 0 i2c_sda_i

create_bd_cell -type ip -vlnv xilinx.com:ip:util_ds_buf:2.1 util_ds_buf_2
set_property -dict {CONFIG.C_BUF_TYPE IOBUF} [get_bd_cells util_ds_buf_2]
create_bd_cell -type ip -vlnv xilinx.com:ip:util_ds_buf:2.1 util_ds_buf_3
set_property -dict {CONFIG.C_BUF_TYPE IOBUF} [get_bd_cells util_ds_buf_3]
create_bd_cell -type ip -vlnv xilinx.com:ip:util_vector_logic:2.0 util_vector_logic_0
set_property -dict {CONFIG.C_SIZE 1} [get_bd_cells util_vector_logic_0]
create_bd_cell -type ip -vlnv xilinx.com:ip:util_vector_logic:2.0 util_vector_logic_1
set_property -dict {CONFIG.C_SIZE 1} [get_bd_cells util_vector_logic_1]
create_bd_cell -type ip -vlnv xilinx.com:ip:util_vector_logic:2.0 util_vector_logic_2
set_property -dict {CONFIG.C_OPERATION or CONFIG.C_SIZE 1} [get_bd_cells util_vector_logic_2]
create_bd_cell -type ip -vlnv xilinx.com:ip:util_vector_logic:2.0 util_vector_logic_3
set_property -dict {CONFIG.C_OPERATION or CONFIG.C_SIZE 1} [get_bd_cells util_vector_logic_3]

# ---- connections ----

current_bd_instance /dp_rx_hier_0
connect_bd_intf_net [get_bd_intf_pins vid_phy_axi4lite] [get_bd_intf_pins vid_phy_controller_0/vid_phy_axi4lite]
connect_bd_intf_net [get_bd_intf_pins ext_iic_0] [get_bd_intf_pins v_dp_rxss1_0/ext_iic]
connect_bd_intf_net [get_bd_intf_pins s_axi2] [get_bd_intf_pins vid_edid_0/s_axi]
connect_bd_intf_net [get_bd_intf_pins s_axi] [get_bd_intf_pins v_dp_rxss1_0/s_axi]
connect_bd_intf_net [get_bd_intf_pins S_AXI1] [get_bd_intf_pins video_frame_crc_0/S_AXI]
connect_bd_intf_net [get_bd_intf_pins aud_axi_egress] [get_bd_intf_pins v_dp_rxss1_0/aud_axi_egress]
connect_bd_intf_net [get_bd_intf_pins Vid_Out_AXIS] [get_bd_intf_pins video_frame_crc_0/Vid_Out_AXIS]
connect_bd_intf_net [get_bd_intf_pins v_dp_rxss1_0/s_axis_lnk_rx_lane2] [get_bd_intf_pins vid_phy_controller_0/vid_phy_rx_axi4s_ch2]
connect_bd_intf_net [get_bd_intf_pins v_dp_rxss1_0/s_axis_lnk_rx_lane3] [get_bd_intf_pins vid_phy_controller_0/vid_phy_rx_axi4s_ch3]
connect_bd_intf_net [get_bd_intf_pins v_dp_rxss1_0/s_axis_lnk_rx_lane1] [get_bd_intf_pins vid_phy_controller_0/vid_phy_rx_axi4s_ch1]
connect_bd_intf_net [get_bd_intf_pins v_dp_rxss1_0/s_axis_lnk_rx_lane0] [get_bd_intf_pins vid_phy_controller_0/vid_phy_rx_axi4s_ch0]
connect_bd_intf_net [get_bd_intf_pins v_dp_rxss1_0/m_axis_video_stream1] [get_bd_intf_pins video_frame_crc_0/Vid_In_AXIS]
connect_bd_intf_net [get_bd_intf_pins v_dp_rxss1_0/m_axis_phy_rx_sb_control] [get_bd_intf_pins vid_phy_controller_0/vid_phy_control_sb_rx]
connect_bd_intf_net [get_bd_intf_pins v_dp_rxss1_0/s_axis_phy_rx_sb_status] [get_bd_intf_pins vid_phy_controller_0/vid_phy_status_sb_rx]
connect_bd_net -net IBUF_DS_N1_1 [get_bd_pins IBUF_DS_N1] [get_bd_pins util_ds_buf_1/IBUF_DS_N]
connect_bd_net [get_bd_pins IBUF_DS_N] [get_bd_pins util_ds_buf_0/IBUF_DS_N]
connect_bd_net -net IBUF_DS_P1_1 [get_bd_pins IBUF_DS_P1] [get_bd_pins util_ds_buf_1/IBUF_DS_P]
connect_bd_net [get_bd_pins IBUF_DS_P] [get_bd_pins util_ds_buf_0/IBUF_DS_P]
connect_bd_net [get_bd_pins v_dp_rxss1_0/edid_iic_scl_t] [get_bd_pins v_dp_rxss1_0/edid_iic_scl_i] [get_bd_pins vid_edid_0/iic_scl_in]
connect_bd_net [get_bd_pins v_dp_rxss1_0/edid_iic_sda_t] [get_bd_pins vid_edid_0/iic_sda_in] [get_bd_pins xlconcat_0/In1]
connect_bd_net -net aux_rx_data_in_0_1 [get_bd_pins aux_rx_data_in_0] [get_bd_pins v_dp_rxss1_0/aux_rx_data_in]
connect_bd_net [get_bd_pins ctl_reset] [get_bd_pins vid_edid_0/ctl_reset]
connect_bd_net -net ext_iic_scl_i_0_1 [get_bd_pins ext_iic_scl_i_0] [get_bd_pins v_dp_rxss1_0/ext_iic_scl_i]
connect_bd_net -net ext_iic_sda_i_0_1 [get_bd_pins ext_iic_sda_i_0] [get_bd_pins v_dp_rxss1_0/ext_iic_sda_i]
connect_bd_net [get_bd_pins m_aud_axis_aresetn] [get_bd_pins v_dp_rxss1_0/m_aud_axis_aresetn] [get_bd_pins v_dp_rxss1_0/s_axi_aresetn]
connect_bd_net [get_bd_pins phy_rxn_in] [get_bd_pins vid_phy_controller_0/phy_rxn_in]
connect_bd_net [get_bd_pins phy_rxp_in] [get_bd_pins vid_phy_controller_0/phy_rxp_in]
connect_bd_net [get_bd_pins rx_vid_rst] [get_bd_pins v_dp_rxss1_0/rx_vid_rst]
connect_bd_net [get_bd_pins util_ds_buf_0/IBUF_OUT] [get_bd_pins vid_phy_controller_0/mgtrefclk0_in]
connect_bd_net [get_bd_pins util_ds_buf_1/IBUF_OUT] [get_bd_pins vid_phy_controller_0/gtnorthrefclk0_in]
connect_bd_net [get_bd_pins util_reduced_logic_0/Res] [get_bd_pins v_dp_rxss1_0/edid_iic_sda_i]
connect_bd_net [get_bd_pins v_dp_rxss1_0/aux_rx_data_en_out_n] [get_bd_pins aux_rx_data_en_out_n_0]
connect_bd_net [get_bd_pins v_dp_rxss1_0/aux_rx_data_out] [get_bd_pins aux_rx_data_out_0]
connect_bd_net [get_bd_pins v_dp_rxss1_0/dprxss_dp_irq] [get_bd_pins dprxss_dp_irq]
connect_bd_net [get_bd_pins v_dp_rxss1_0/dprxss_iic_irq] [get_bd_pins dprxss_iic_irq]
connect_bd_net [get_bd_pins v_dp_rxss1_0/ext_iic_scl_o] [get_bd_pins ext_iic_scl_o_0]
connect_bd_net [get_bd_pins v_dp_rxss1_0/ext_iic_scl_t] [get_bd_pins ext_iic_scl_t_0]
connect_bd_net [get_bd_pins v_dp_rxss1_0/ext_iic_sda_o] [get_bd_pins ext_iic_sda_o_0]
connect_bd_net [get_bd_pins v_dp_rxss1_0/ext_iic_sda_t] [get_bd_pins ext_iic_sda_t_0]
connect_bd_net [get_bd_pins v_dp_rxss1_0/ext_rst] [get_bd_pins ext_rst]
connect_bd_net [get_bd_pins v_dp_rxss1_0/rx_hpd] [get_bd_pins rx_hpd]
connect_bd_net [get_bd_pins vid_edid_0/iic_sda_out] [get_bd_pins xlconcat_0/In0]
connect_bd_net [get_bd_pins vid_phy_axi4lite_aresetn] \
  [get_bd_pins vid_edid_0/s_axi_aresetn] [get_bd_pins vid_phy_controller_0/vid_phy_axi4lite_aresetn] \
  [get_bd_pins vid_phy_controller_0/vid_phy_sb_aresetn] [get_bd_pins video_frame_crc_0/s_axi_aresetn]
connect_bd_net [get_bd_pins vid_phy_controller_0/irq] [get_bd_pins phy_irq]
connect_bd_net [get_bd_pins vid_phy_controller_0/rxoutclk] \
  [get_bd_pins v_dp_rxss1_0/rx_lnk_clk] [get_bd_pins vid_phy_controller_0/vid_phy_rx_axi4s_aclk]
connect_bd_net [get_bd_pins xlconcat_0/dout] [get_bd_pins util_reduced_logic_0/Op1]
connect_bd_net [get_bd_pins xlconstant_0/dout] [get_bd_pins B_SOURCE_AUX_DE] [get_bd_pins B_SOURCE_RST]
connect_bd_net [get_bd_pins xlconstant_1/dout] \
  [get_bd_pins B_SOURCE_EN] [get_bd_pins vid_phy_controller_0/vid_phy_rx_axi4s_aresetn] \
  [get_bd_pins video_frame_crc_0/vid_in_axis_aresetn]
connect_bd_net [get_bd_pins xlconstant_2/dout] \
  [get_bd_pins vid_phy_controller_0/gtnorthrefclk00_in] [get_bd_pins vid_phy_controller_0/gtnorthrefclk01_in] \
  [get_bd_pins vid_phy_controller_0/gtnorthrefclk10_in] [get_bd_pins vid_phy_controller_0/gtnorthrefclk11_in] \
  [get_bd_pins vid_phy_controller_0/gtnorthrefclk1_in] [get_bd_pins vid_phy_controller_0/gtsouthrefclk00_in] \
  [get_bd_pins vid_phy_controller_0/gtsouthrefclk01_in] [get_bd_pins vid_phy_controller_0/gtsouthrefclk0_in] \
  [get_bd_pins vid_phy_controller_0/gtsouthrefclk10_in] [get_bd_pins vid_phy_controller_0/gtsouthrefclk11_in] \
  [get_bd_pins vid_phy_controller_0/gtsouthrefclk1_in] [get_bd_pins vid_phy_controller_0/mgtrefclk1_in]
connect_bd_net -net zynq_ultra_ps_e_0_pl_clk0 [get_bd_pins vid_phy_axi4lite_aclk] \
  [get_bd_pins v_dp_rxss1_0/m_aud_axis_aclk] [get_bd_pins v_dp_rxss1_0/s_axi_aclk] [get_bd_pins vid_edid_0/ctl_clk] \
  [get_bd_pins vid_edid_0/s_axi_aclk] [get_bd_pins vid_phy_controller_0/vid_phy_axi4lite_aclk] \
  [get_bd_pins vid_phy_controller_0/vid_phy_sb_aclk] [get_bd_pins video_frame_crc_0/s_axi_aclk]
connect_bd_net -net zynq_ultra_ps_e_0_pl_clk1 [get_bd_pins drpclk] [get_bd_pins vid_phy_controller_0/drpclk]
connect_bd_net -net zynq_ultra_ps_e_0_pl_clk2 [get_bd_pins m_axis_aclk_stream1] \
  [get_bd_pins v_dp_rxss1_0/m_axis_aclk_stream1] [get_bd_pins v_dp_rxss1_0/rx_vid_clk] \
  [get_bd_pins video_frame_crc_0/vid_in_axis_aclk]

current_bd_instance /i2c_mux
connect_bd_net [get_bd_pins i2c_sda] [get_bd_pins util_ds_buf_2/IOBUF_IO_IO]
connect_bd_net [get_bd_pins i2c_scl] [get_bd_pins util_ds_buf_3/IOBUF_IO_IO]
connect_bd_net [get_bd_pins i2c_a_scl_o] [get_bd_pins util_vector_logic_3/Op1]
connect_bd_net [get_bd_pins i2c_a_scl_t] [get_bd_pins util_vector_logic_1/Op1]
connect_bd_net [get_bd_pins i2c_a_sda_o] [get_bd_pins util_vector_logic_2/Op1]
connect_bd_net [get_bd_pins i2c_a_sda_t] [get_bd_pins util_vector_logic_0/Op1]
connect_bd_net [get_bd_pins i2c_b_scl_o] [get_bd_pins util_vector_logic_3/Op2]
connect_bd_net [get_bd_pins i2c_b_scl_t] [get_bd_pins util_vector_logic_1/Op2]
connect_bd_net [get_bd_pins i2c_b_sda_o] [get_bd_pins util_vector_logic_2/Op2]
connect_bd_net [get_bd_pins i2c_b_sda_t] [get_bd_pins util_vector_logic_0/Op2]
connect_bd_net [get_bd_pins util_ds_buf_2/IOBUF_IO_O] [get_bd_pins i2c_sda_i]
connect_bd_net [get_bd_pins util_ds_buf_3/IOBUF_IO_O] [get_bd_pins i2c_scl_i]
connect_bd_net [get_bd_pins util_vector_logic_0/Res] [get_bd_pins util_ds_buf_2/IOBUF_IO_T]
connect_bd_net [get_bd_pins util_vector_logic_1/Res] [get_bd_pins util_ds_buf_3/IOBUF_IO_T]
connect_bd_net [get_bd_pins util_vector_logic_2/Res] [get_bd_pins util_ds_buf_2/IOBUF_IO_I]
connect_bd_net [get_bd_pins util_vector_logic_3/Res] [get_bd_pins util_ds_buf_3/IOBUF_IO_I]

current_bd_instance /
connect_bd_intf_net [get_bd_intf_pins dp_rx_hier_0/s_axi] [get_bd_intf_pins ps8_0_axi_periph/M02_AXI]
connect_bd_intf_net [get_bd_intf_pins dp_rx_hier_0/vid_phy_axi4lite] [get_bd_intf_pins ps8_0_axi_periph/M04_AXI]
connect_bd_intf_net [get_bd_intf_pins dp_rx_hier_0/S_AXI1] [get_bd_intf_pins ps8_0_axi_periph/M05_AXI]
connect_bd_intf_net [get_bd_intf_pins dp_rx_hier_0/aud_axi_egress] [get_bd_intf_pins system_ila_1/SLOT_0_AXIS]
connect_bd_intf_net [get_bd_intf_ports ext_iic_0] [get_bd_intf_pins dp_rx_hier_0/ext_iic_0]
connect_bd_intf_net [get_bd_intf_pins axi_iic_0/S_AXI] [get_bd_intf_pins ps8_0_axi_periph/M01_AXI]
connect_bd_intf_net [get_bd_intf_pins dp_rx_hier_0/s_axi2] [get_bd_intf_pins ps8_0_axi_periph/M03_AXI]
connect_bd_intf_net [get_bd_intf_pins dp_rx_hier_0/Vid_Out_AXIS] [get_bd_intf_pins system_ila_2/SLOT_0_AXIS]
connect_bd_intf_net [get_bd_intf_pins axi_timer_0/S_AXI] [get_bd_intf_pins ps8_0_axi_periph/M00_AXI]
connect_bd_intf_net [get_bd_intf_ports user_si570_sysclk] [get_bd_intf_pins clk_wiz_0/CLK_IN1_D]
connect_bd_intf_net [get_bd_intf_pins ps8_0_axi_periph/S00_AXI] [get_bd_intf_pins zynq_ultra_ps_e_0/M_AXI_HPM1_FPD]
connect_bd_intf_net [get_bd_intf_pins ps8_0_axi_periph/S01_AXI] [get_bd_intf_pins zynq_ultra_ps_e_0/M_AXI_HPM0_FPD]
connect_bd_net -net IBUF_DS_N1_1 [get_bd_ports IBUF_DS_N1] [get_bd_pins dp_rx_hier_0/IBUF_DS_N1]
connect_bd_net [get_bd_ports IBUF_DS_N] [get_bd_pins dp_rx_hier_0/IBUF_DS_N]
connect_bd_net -net IBUF_DS_P1_1 [get_bd_ports IBUF_DS_P1] [get_bd_pins dp_rx_hier_0/IBUF_DS_P1]
connect_bd_net [get_bd_ports IBUF_DS_P] [get_bd_pins dp_rx_hier_0/IBUF_DS_P]
connect_bd_net [get_bd_ports i2c_scl] [get_bd_pins i2c_mux/i2c_scl]
connect_bd_net [get_bd_ports i2c_sda] [get_bd_pins i2c_mux/i2c_sda]
connect_bd_net -net aux_rx_data_in_0_1 [get_bd_ports aux_rx_data_in_0] [get_bd_pins dp_rx_hier_0/aux_rx_data_in_0]
connect_bd_net [get_bd_pins axi_iic_0/iic2intc_irpt] [get_bd_pins xlconcat_0/In2]
connect_bd_net -net ctl_reset_1 [get_bd_pins rst_ps8_0_99M/peripheral_reset] [get_bd_pins dp_rx_hier_0/ctl_reset]
connect_bd_net [get_bd_pins dp_rx_hier_0/B_SOURCE_EN] [get_bd_pins dp_rx_hier_0/m_aud_axis_aresetn]
connect_bd_net [get_bd_pins dp_rx_hier_0/aux_rx_data_en_out_n_0] [get_bd_pins util_vector_logic_1/Op1]
connect_bd_net [get_bd_pins dp_rx_hier_0/aux_rx_data_out_0] [get_bd_ports aux_rx_data_out_0]
connect_bd_net [get_bd_pins dp_rx_hier_0/dprxss_dp_irq] [get_bd_pins xlconcat_0/In0]
connect_bd_net [get_bd_pins dp_rx_hier_0/ext_iic_scl_o_0] [get_bd_pins i2c_mux/i2c_b_scl_o]
connect_bd_net [get_bd_pins dp_rx_hier_0/ext_iic_scl_t_0] [get_bd_pins i2c_mux/i2c_b_scl_t]
connect_bd_net [get_bd_pins dp_rx_hier_0/ext_iic_sda_o_0] [get_bd_pins i2c_mux/i2c_b_sda_o]
connect_bd_net [get_bd_pins dp_rx_hier_0/ext_iic_sda_t_0] [get_bd_pins i2c_mux/i2c_b_sda_t]
connect_bd_net [get_bd_pins dp_rx_hier_0/phy_irq] [get_bd_pins xlconcat_0/In1]
connect_bd_net [get_bd_pins dp_rx_hier_0/rx_hpd] [get_bd_ports rx_hpd]
connect_bd_net -net drpclk_1 [get_bd_pins clk_wiz_0/clk_out1] [get_bd_pins dp_rx_hier_0/drpclk]
connect_bd_net -net i2c_a_scl_o_1 [get_bd_pins axi_iic_0/scl_o] [get_bd_pins i2c_mux/i2c_a_scl_o]
connect_bd_net -net i2c_a_scl_t_1 [get_bd_pins axi_iic_0/scl_t] [get_bd_pins i2c_mux/i2c_a_scl_t]
connect_bd_net -net i2c_a_sda_o_1 [get_bd_pins axi_iic_0/sda_o] [get_bd_pins i2c_mux/i2c_a_sda_o]
connect_bd_net -net i2c_a_sda_t_1 [get_bd_pins axi_iic_0/sda_t] [get_bd_pins i2c_mux/i2c_a_sda_t]
connect_bd_net [get_bd_pins i2c_mux/i2c_scl_i] [get_bd_pins axi_iic_0/scl_i] [get_bd_pins dp_rx_hier_0/ext_iic_scl_i_0]
connect_bd_net [get_bd_pins i2c_mux/i2c_sda_i] [get_bd_pins axi_iic_0/sda_i] [get_bd_pins dp_rx_hier_0/ext_iic_sda_i_0]
connect_bd_net -net m_axis_aclk_stream1_1 [get_bd_pins clk_wiz_0/clk_out2] \
  [get_bd_pins dp_rx_hier_0/m_axis_aclk_stream1] [get_bd_pins proc_sys_reset_0/slowest_sync_clk] \
  [get_bd_pins system_ila_2/clk]
connect_bd_net [get_bd_ports phy_rxn_in] [get_bd_pins dp_rx_hier_0/phy_rxn_in]
connect_bd_net [get_bd_ports phy_rxp_in] [get_bd_pins dp_rx_hier_0/phy_rxp_in]
connect_bd_net [get_bd_pins proc_sys_reset_0/peripheral_reset] [get_bd_pins dp_rx_hier_0/rx_vid_rst]
connect_bd_net [get_bd_ports reset] [get_bd_pins clk_wiz_0/reset]
connect_bd_net [get_bd_pins rst_ps8_0_99M/interconnect_aresetn] [get_bd_pins ps8_0_axi_periph/ARESETN]
connect_bd_net [get_bd_pins rst_ps8_0_99M/peripheral_aresetn] \
  [get_bd_pins axi_iic_0/s_axi_aresetn] [get_bd_pins axi_timer_0/s_axi_aresetn] \
  [get_bd_pins dp_rx_hier_0/vid_phy_axi4lite_aresetn] [get_bd_pins ps8_0_axi_periph/M00_ARESETN] \
  [get_bd_pins ps8_0_axi_periph/M01_ARESETN] [get_bd_pins ps8_0_axi_periph/M02_ARESETN] \
  [get_bd_pins ps8_0_axi_periph/M03_ARESETN] [get_bd_pins ps8_0_axi_periph/M04_ARESETN] \
  [get_bd_pins ps8_0_axi_periph/M05_ARESETN] [get_bd_pins ps8_0_axi_periph/M06_ARESETN] \
  [get_bd_pins ps8_0_axi_periph/M07_ARESETN] [get_bd_pins ps8_0_axi_periph/S00_ARESETN] \
  [get_bd_pins ps8_0_axi_periph/S01_ARESETN] [get_bd_pins system_ila_1/resetn]
connect_bd_net [get_bd_pins util_vector_logic_1/Res] [get_bd_ports aux_rx_data_en_out_n_0]
connect_bd_net [get_bd_pins xlconcat_0/dout] [get_bd_pins zynq_ultra_ps_e_0/pl_ps_irq0]
connect_bd_net [get_bd_pins xlconstant_0/dout] \
  [get_bd_pins dp_rx_hier_0/Vid_Out_AXIS_tready] [get_bd_pins dp_rx_hier_0/aud_axi_egress_tready] \
  [get_bd_pins system_ila_1/SLOT_0_AXIS_tready] [get_bd_pins system_ila_2/SLOT_0_AXIS_tready] \
  [get_bd_pins system_ila_2/resetn]
connect_bd_net [get_bd_pins xlconstant_1/dout] [get_bd_ports B_SOURCE_AUX_DE] [get_bd_ports B_SOURCE_RST] [get_bd_ports pwd]
connect_bd_net [get_bd_pins zynq_ultra_ps_e_0/pl_clk0] \
  [get_bd_pins axi_iic_0/s_axi_aclk] [get_bd_pins axi_timer_0/s_axi_aclk] [get_bd_pins dp_rx_hier_0/vid_phy_axi4lite_aclk] \
  [get_bd_pins ps8_0_axi_periph/ACLK] [get_bd_pins ps8_0_axi_periph/M00_ACLK] [get_bd_pins ps8_0_axi_periph/M01_ACLK] \
  [get_bd_pins ps8_0_axi_periph/M02_ACLK] [get_bd_pins ps8_0_axi_periph/M03_ACLK] [get_bd_pins ps8_0_axi_periph/M04_ACLK] \
  [get_bd_pins ps8_0_axi_periph/M05_ACLK] [get_bd_pins ps8_0_axi_periph/M06_ACLK] [get_bd_pins ps8_0_axi_periph/M07_ACLK] \
  [get_bd_pins ps8_0_axi_periph/S00_ACLK] [get_bd_pins ps8_0_axi_periph/S01_ACLK] \
  [get_bd_pins rst_ps8_0_99M/slowest_sync_clk] [get_bd_pins system_ila_1/clk] \
  [get_bd_pins zynq_ultra_ps_e_0/maxihpm0_fpd_aclk] [get_bd_pins zynq_ultra_ps_e_0/maxihpm1_fpd_aclk]
connect_bd_net [get_bd_pins zynq_ultra_ps_e_0/pl_resetn0] [get_bd_pins proc_sys_reset_0/ext_reset_in] [get_bd_pins rst_ps8_0_99M/ext_reset_in]

# ---- address map ----
assign_bd_address -offset 0x00A0000000 -range 64K -target_address_space [get_bd_addr_spaces zynq_ultra_ps_e_0/Data] [get_bd_addr_segs axi_timer_0/S_AXI/Reg]
assign_bd_address -offset 0x00A0010000 -range 64K -target_address_space [get_bd_addr_spaces zynq_ultra_ps_e_0/Data] [get_bd_addr_segs dp_rx_hier_0/vid_edid_0/s_axi/Reg]
assign_bd_address -offset 0x00A0020000 -range 64K -target_address_space [get_bd_addr_spaces zynq_ultra_ps_e_0/Data] [get_bd_addr_segs dp_rx_hier_0/vid_phy_controller_0/vid_phy_axi4lite/Reg]
assign_bd_address -offset 0x00A0030000 -range 64K -target_address_space [get_bd_addr_spaces zynq_ultra_ps_e_0/Data] [get_bd_addr_segs dp_rx_hier_0/video_frame_crc_0/S_AXI/Reg]
assign_bd_address -offset 0x00A0040000 -range 256K -target_address_space [get_bd_addr_spaces zynq_ultra_ps_e_0/Data] [get_bd_addr_segs dp_rx_hier_0/v_dp_rxss1_0/s_axi/Reg]
assign_bd_address -offset 0x00A0080000 -range 4K -target_address_space [get_bd_addr_spaces zynq_ultra_ps_e_0/Data] [get_bd_addr_segs axi_iic_0/S_AXI/Reg]

validate_bd_design
save_bd_design
